# EasyEDA Pro project ProPrj_rp2040_2024-07-06.epro

# Schematic Schematic1
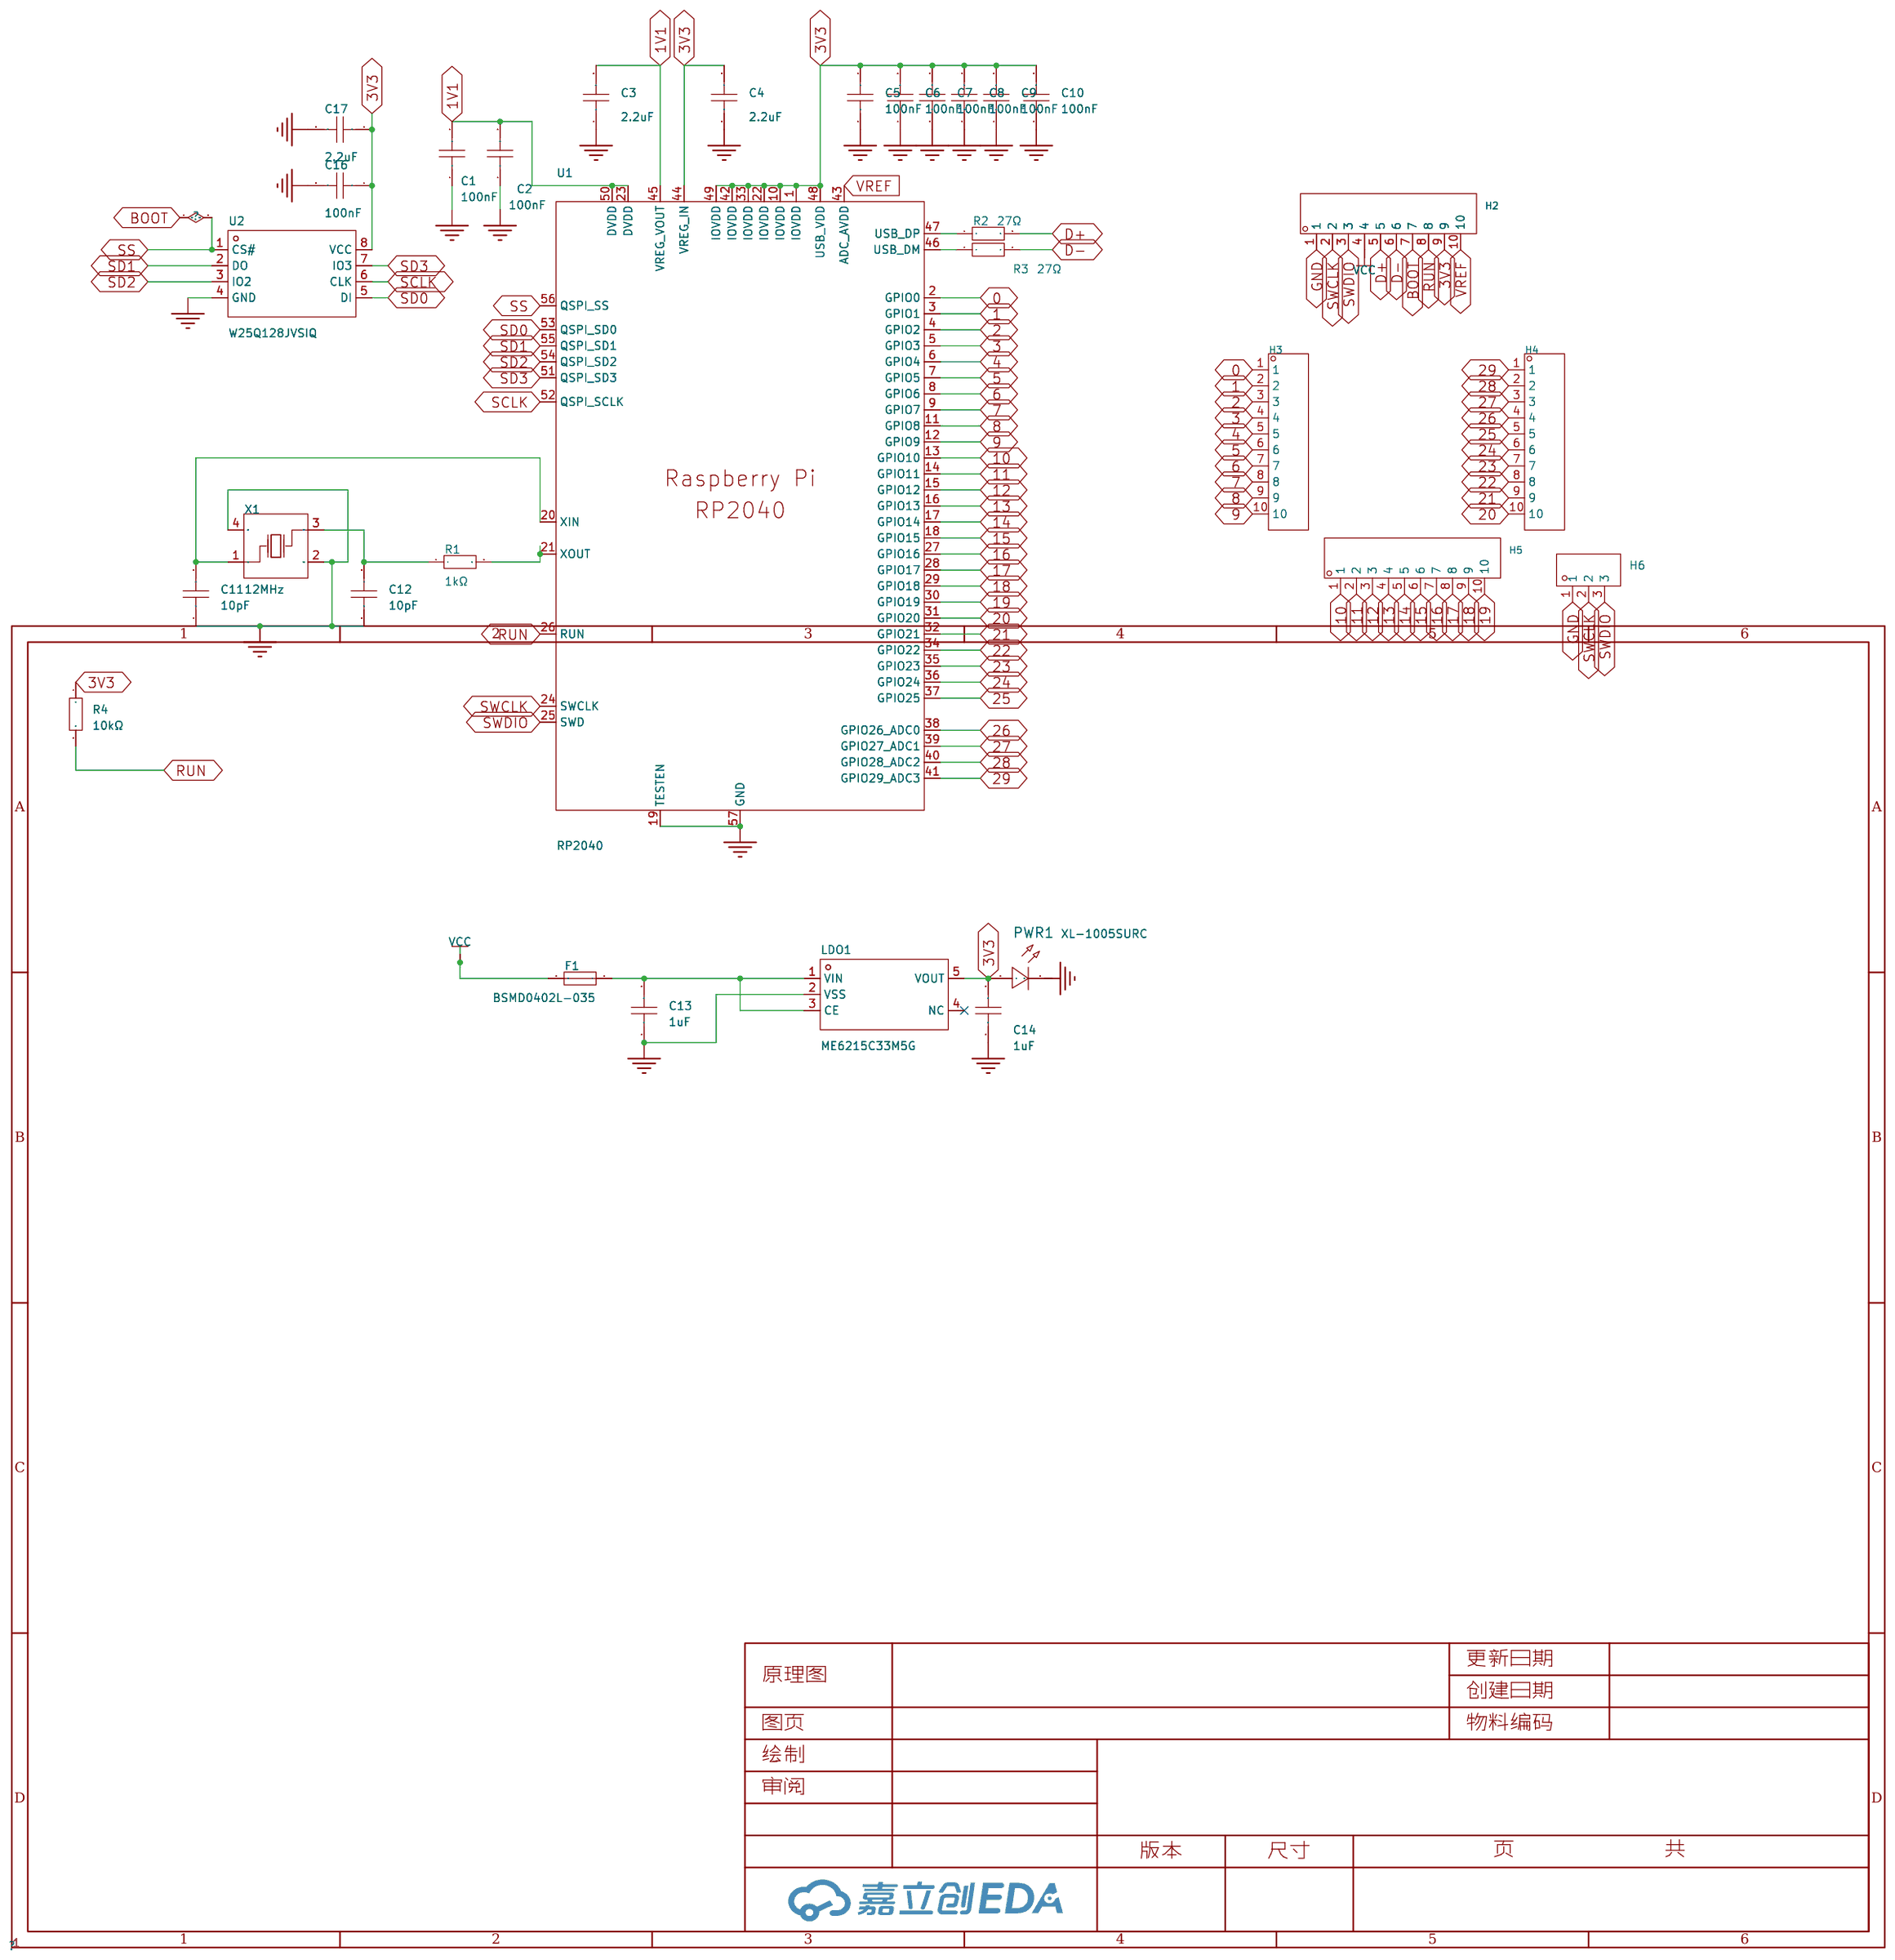
[diagram p0: schematic sheet]

## Parts
C1  100nF  [C0402]
C2  100nF  [C0402]
C3  2.2uF  [C0402]
C4  2.2uF  [C0402]
C5  100nF  [C0402]
C6  100nF  [C0402]
C7  100nF  [C0402]
C8  100nF  [C0402]
C9  100nF  [C0402]
C10  100nF  [C0402]
C11  10pF  [C0402]
C12  10pF  [C0402]
C13  1uF  [C0402]
C14  1uF  [C0402]
C16  100nF  [C0402]
C17  2.2uF  [C0402]
F1  BSMD0402L-035  [F0402]
H2  -  [HDR-TH_10P-P2.54-V-M-1]
H3  -  [HDR-TH_10P-P2.54-V-M-1]
H4  -  [HDR-TH_10P-P2.54-V-M-1]
H5  -  [HDR-TH_10P-P2.54-V-M-1]
H6  -  [HDR-TH_3P-P2.54-V-M]
LDO1  ME6215C33M5G  [SOT-23-5_L3.0-W1.7-P0.95-LS2.8-BR]
PWR1  XL-1005SURC  [LED0402-R-RD_RED]
R1  1kΩ  [R0402]
R2  27Ω  [R0402]
R3  27Ω  [R0402]
R4  10kΩ  [R0402]
U1  RP2040  [LQFN-56_L7.0-W7.0-P0.4-EP]
U2  W25Q128JVSIQ  [SOIC-8_L5.3-W5.3-P1.27-LS8.0-BL]
X1  12MHz  [CRYSTAL-SMD_4P-L3.2-W2.5-BL]

## Library data of the parts
C1 C2 C5-C10 C16 = CC0402KRX7R7BB104: 容值:100nF;精度:±10%;额定电压:16V;材质(温度系数):X7R;; LCSC Part Name: 100nF ±10% 16V; Supplier Part: C60474; Manufacturer: YAGEO(国巨); Supplier Footprint: 0402; JLCPCB Part Class: Extended Part; Datasheet: https://atta.szlcsc.com/upload/public/pdf/source/20211223/9278FD768280B81DDBEF48FA36411A03.pdf; Supplier: LCSC; Tolerance: ±10%; Voltage Rated: 16V; Temperature Coefficient: X7R; Check: true
C3 C4 C17 = CL05A225KP5NSNC: 容值:2.2uF;精度:±10%;额定电压:10V;材质(温度系数):X5R;; LCSC Part Name: 2.2uF ±10% 10V; Supplier Part: C107369; Manufacturer: SAMSUNG(三星); Supplier Footprint: 0402; JLCPCB Part Class: Extended Part; Datasheet: https://atta.szlcsc.com/upload/public/pdf/source/20160218/1457707763339.pdf; Supplier: LCSC; Tolerance: ±10%; Voltage Rated: 10V; Temperature Coefficient: X5R; Check: true
C11 C12 = 0402CG100J500NT: 容值:10pF;精度:±5%;额定电压:50V;材质(温度系数):C0G;; LCSC Part Name: 10pF ±5% 50V; Supplier Part: C1545; Manufacturer: FH(风华); Supplier Footprint: 0402; JLCPCB Part Class: Extended Part; Datasheet: https://atta.szlcsc.com/upload/public/pdf/source/20200305/C486355_26A10D38EF8C2A5C37091D0039909270.pdf; Supplier: LCSC; Tolerance: ±5%; Voltage Rated: 50V; Temperature Coefficient: C0G; Check: true
C13 C14 = CL05A105KP5NNNC: 容值:1uF;精度:±10%;额定电压:10V;材质(温度系数):X5R;; LCSC Part Name: 1uF ±10% 10V; Supplier Part: C14445; Manufacturer: SAMSUNG(三星); Supplier Footprint: 0402; JLCPCB Part Class: Extended Part; Datasheet: https://atta.szlcsc.com/upload/public/pdf/source/20160218/1457707763339.pdf; Supplier: LCSC; Tolerance: ±10%; Voltage Rated: 10V; Temperature Coefficient: X5R; Check: true
F1 = BSMD0402L-035: 最大电压:6V;最大电流:40A;保持电流:350mA;跳闸电流:700mA;; LCSC Part Name: 6V 350mA 0402自恢复; Supplier Part: C914086; Manufacturer: BHFUSE(佰宏); Supplier Footprint: 0402; JLCPCB Part Class: 扩展库; Datasheet: https://atta.szlcsc.com/upload/public/pdf/source/20230512/81993D19BE7C594631D65321B72A7525.pdf; Supplier: LCSC; Operating Voltage (Max): 6V; Current Rating (Max): 40A; Hold Current: 350mA; Trip Current: 700mA; Power Dissipation: 500mW; Resistance - Initial (Ri) (Min): 50mΩ; Resistance - Post Trip (R1) (Max): 700mΩ; Maximum Time to Trip: 100ms; Operating Temperature: -40℃~+85℃; Check: true
H2-H5 = HDR-M_2.54_1x10P: Supplier Part: C57369; Supplier Footprint: 插件; Check: false
H6 = HDR-M_2.54_1x3P: Supplier Part: C2937625; Supplier Footprint: 插件; Check: false
LDO1 = ME6215C33M5G: 输出类型:固定;最大输入电压:18V;输出电压:3.3V;最大输出电流:350mA;电源纹波抑制比(PSRR):-;输出极性:正极;; LCSC Part Name: 输入18V 输出3.3V 350mA; Supplier Part: C84119; Manufacturer: MICRONE(南京微盟); Supplier Footprint: SOT-23-5; JLCPCB Part Class: 扩展库; Datasheet: https://atta.szlcsc.com/upload/public/pdf/source/20161013/1476322246618.pdf; Supplier: LCSC; Output Type: 固定; Maximum Input Voltage: 18V; Output Voltage: 3.3V; MAX Output Current: 350mA; Dropout Voltage: 320mV@(200mA); Output Polarity: 正极; Number of Outputs: 1; Check: true
PWR1 = XL-1005SURC: 发光颜色:红色;功率:55mW;正向电流:25mA;主波长:620nm;透镜颜色:无色透明透镜;色温:6000K~7000K;发光角度:120°;载带方式:正贴;工作温度:-30℃~+85℃;; Supplier Part: C965790; Manufacturer: XINGLIGHT(成兴光); Supplier Footprint: 0402; JLCPCB Part Class: Extended Part; Datasheet: https://atta.szlcsc.com/upload/public/pdf/source/20221102/EBA3AB29C2D5B62EE70B36967F8F8809.pdf; Supplier: LCSC; Emitted Color: 红色; Power Dissipation: 55mW; Forward Current: 25mA; Dominant Wavelength: 620nm; Peak Wavelength: 625nm; Lens Color: 无色透明透镜; Color Temperature: 6000K~7000K; Viewing Angle: 120°; Mounting Sytle: 正贴; Operating Temperature: -30℃~+85℃; Check: true
R1 = 0402WGF1001TCE: 电阻类型:厚膜电阻;阻值:1kΩ;精度:±1%;功率:62.5mW;最大工作电压:50V;温度系数:±100ppm/℃;; LCSC Part Name: 1kΩ ±1% 62.5mW 厚膜电阻; Supplier Part: C11702; Manufacturer: UNI-ROYAL(厚声); Supplier Footprint: 0402; JLCPCB Part Class: Basic Part; Datasheet: https://atta.szlcsc.com/upload/public/pdf/source/20200306/C422600_1E6D84923E4A46A82E41ADD87F860B5C.pdf; Supplier: LCSC; Type: 厚膜电阻; Tolerance: ±1%; Power(Watts): 62.5mW; Overload Voltage (Max): 50V; Temperature Coefficient: ±100ppm/℃; Operating Temperature Range: -55℃~+155℃; Check: true
R2 R3 = 0402WGF270JTCE: 电阻类型:厚膜电阻;阻值:27Ω;精度:±1%;功率:62.5mW;最大工作电压:50V;温度系数:±100ppm/℃;; LCSC Part Name: 27Ω ±1% 62.5mW 厚膜电阻; Supplier Part: C25100; Manufacturer: UNI-ROYAL(厚声); Supplier Footprint: 0402; JLCPCB Part Class: Extended Part; Datasheet: https://atta.szlcsc.com/upload/public/pdf/source/20200306/C422600_1E6D84923E4A46A82E41ADD87F860B5C.pdf; Supplier: LCSC; Type: 厚膜电阻; Tolerance: ±1%; Power(Watts): 62.5mW; Overload Voltage (Max): 50V; Temperature Coefficient: ±100ppm/℃; Operating Temperature Range: -55℃~+155℃; Check: true
R4 = RC0402FR-0710KL: 电阻类型:厚膜电阻;阻值:10kΩ;精度:±1%;功率:62.5mW;最大工作电压:50V;温度系数:±100ppm/℃;; LCSC Part Name: 厚膜电阻 10kΩ ±1% 62.5mW; Supplier Part: C60490; Manufacturer: YAGEO(国巨); Supplier Footprint: 0402; JLCPCB Part Class: Extended Part; Datasheet: https://atta.szlcsc.com/upload/public/pdf/source/20170925/C131467_1506321478108990263.pdf; Supplier: LCSC; Type: 厚膜电阻; Tolerance: ±1%; Power(Watts): 62.5mW; Overload Voltage (Max): 50V; Temperature Coefficient: ±100ppm/℃; Operating Temperature Range: -55℃~+155℃; Check: true
U1 = RP2040_C2040: CPU内核:-;RAM总容量:264KB;GPIO端口数量:30;工作电压范围:-;CPU最大主频:133MHz;程序存储器类型:-;应用领域:-;; LCSC Part Name: RP2040（RP2B2）; Supplier Part: C2040; Manufacturer: Raspberry Pi(树莓派); Supplier Footprint: LQFN-56(7x7); JLCPCB Part Class: 扩展库; Datasheet: https://atta.szlcsc.com/upload/public/pdf/source/20210621/C2040_96F425825606B7957D87DD32E2512CA9.pdf; Supplier: LCSC; RAM Size: 264KB; GPIO Ports Number: 30; CPU Maximum Speed: 133MHz; ADC (Bit): 12bit; UART/USART: 2; I2C: 2; SPI: 2; Universal Serial Bus: 有; Peripheral/Function: DMA；PWM; Direct Memory Access: 有; Check: true
U2 = W25Q128JVSIQ: 接口类型:-;存储容量:128Mbit;时钟频率(fc):-;; LCSC Part Name: W25Q128JVSIQ 编带; Supplier Part: C97521; Manufacturer: WINBOND(华邦); Supplier Footprint: SOIC-8-208mil; JLCPCB Part Class: 基础库; Datasheet: https://atta.szlcsc.com/upload/public/pdf/source/20170316/1489627409956.pdf; Supplier: LCSC; Memory Size: 128Mbit; Check: true
X1 = SX3B12.000F1510F30: 晶振类型:贴片晶振;频率:12MHz;常温频差:±10ppm;外接负载电容:15pF;频率稳定度(全温):±30ppm;; LCSC Part Name: 12MHz ±10ppm 15pF; Supplier Part: C2901651; Manufacturer: SCTF(星通时频); Supplier Footprint: SMD3225-4P; JLCPCB Part Class: Extended Part; Datasheet: https://atta.szlcsc.com/upload/public/pdf/source/20211009/5A52FEEAB809802F11C53C4F9B1D6590.pdf; Supplier: LCSC; Crystal Type: 贴片晶振; Normal temperature Frequency Tolerance: ±10ppm; External load capacitor: 15pF; Frequency Stability(Full temperature range): ±30ppm; Equivalent Series Resistance (ESR): 100Ω; Operating Temperature: -40℃~+85℃; Check: true

## Nets
1V1: C1.2 C2.2 C3.2 U1.23(DVDD) U1.45(VREG_VOUT) U1.50(DVDD)
3V3: C4.2 C5.2 C6.2 C7.2 C8.2 C9.2 C10.2 C14.2 C16.1 C17.1 H2.9 LDO1.5(VOUT) PWR1.2(A) R4.1 U1.1(IOVDD) U1.10(IOVDD) U1.22(IOVDD) U1.33(IOVDD) U1.42(IOVDD) U1.44(VREG_IN) U1.48(USB_VDD) U1.49(IOVDD) U2.8(VCC)
GND: C1.1 C2.1 C3.1 C4.1 C5.1 C6.1 C7.1 C8.1 C9.1 C10.1 C11.1 C12.1 C13.1 C14.1 C16.2 C17.2 H2.1 H6.1 LDO1.2(VSS) PWR1.1(C) U1.19(TESTEN) U1.57(GND) U2.4(GND) X1.2(GND) X1.4(GND)
VCC: F1.2 H2.4
0: H3.1 U1.2(GPIO0)
1: H3.2 U1.3(GPIO1)
2: H3.3 U1.4(GPIO2)
3: H3.4 U1.5(GPIO3)
4: H3.5 U1.6(GPIO4)
5: H3.6 U1.7(GPIO5)
6: H3.7 U1.8(GPIO6)
7: H3.8 U1.9(GPIO7)
8: H3.9 U1.11(GPIO8)
9: H3.10 U1.12(GPIO9)
10: H5.1 U1.13(GPIO10)
11: H5.2 U1.14(GPIO11)
12: H5.3 U1.15(GPIO12)
13: H5.4 U1.16(GPIO13)
14: H5.5 U1.17(GPIO14)
15: H5.6 U1.18(GPIO15)
16: H5.7 U1.27(GPIO16)
17: H5.8 U1.28(GPIO17)
18: H5.9 U1.29(GPIO18)
19: H5.10 U1.30(GPIO19)
20: H4.10 U1.31(GPIO20)
21: H4.9 U1.32(GPIO21)
22: H4.8 U1.34(GPIO22)
23: H4.7 U1.35(GPIO23)
24: H4.6 U1.36(GPIO24)
25: H4.5 U1.37(GPIO25)
26: H4.4 U1.38(GPIO26_ADC0)
27: H4.3 U1.39(GPIO27_ADC1)
28: H4.2 U1.40(GPIO28_ADC2)
29: H4.1 U1.41(GPIO29_ADC3)
BOOT: H2.7 U1.56(QSPI_SS) U2.1(CS#)
D+: H2.5 R2.2
D-: H2.6 R3.2
RUN: H2.8 R4.2 U1.26(RUN)
SCLK: U1.52(QSPI_SCLK) U2.6(CLK)
SD0: U1.53(QSPI_SD0) U2.5(DI)
SD1: U1.55(QSPI_SD1) U2.2(DO)
SD2: U1.54(QSPI_SD2) U2.3(IO2)
SD3: U1.51(QSPI_SD3) U2.7(IO3)
SWCLK: H2.2 H6.2 U1.24(SWCLK)
SWDIO: H2.3 H6.3 U1.25(SWD)
VREF: H2.10 U1.43(ADC_AVDD)
$1N2199: C11.2 U1.20(XIN) X1.1(OSC1)
$1N2386: R1.2 U1.21(XOUT)
$1N2391: C12.2 R1.1 X1.3(OSC2)
$1N3425: C13.2 F1.1 LDO1.1(VIN) LDO1.3(CE)
$1N3838: R2.1 U1.47(USB_DP)
$1N3897: R3.1 U1.46(USB_DM)

Not connected (* = marked no-connect by the designer): LDO1 4(NC)*

# Board PCB1
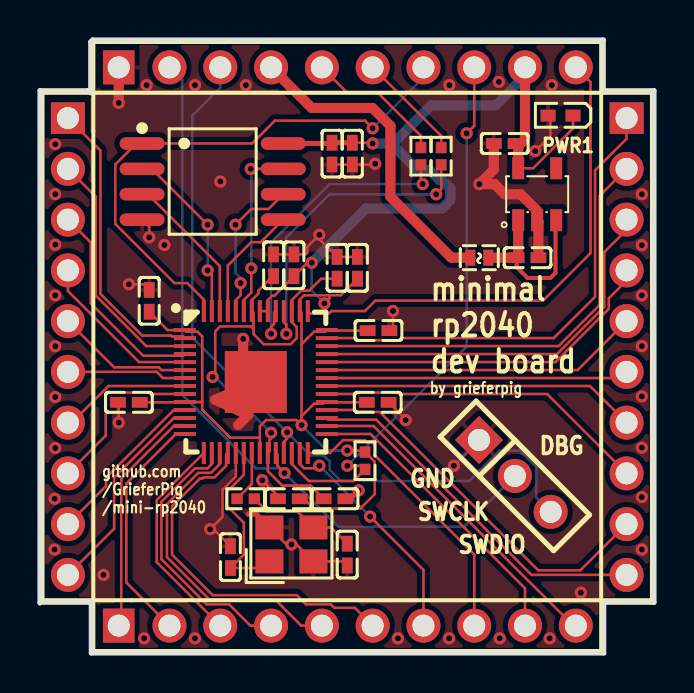
[diagram p1: board, top side]
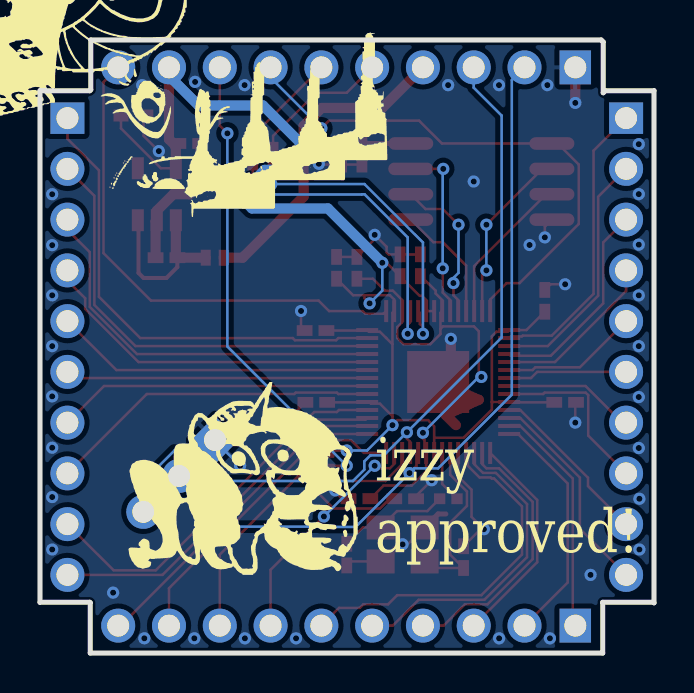
[diagram p2: board, bottom side, seen from below]

Outline 30.71 x 30.68 mm; copper layers: Top Layer, Inner1, Inner2, Bottom Layer. Coordinates in mm from the lower left corner of the outline.
Outline path: 0,28.14 2.44,28.14 2.54,28.04 2.54,30.58 2.64,30.68 28.17,30.68 28.17,28.19 28.22,28.14 30.71,28.14 30.71,2.54 28.22,2.54 28.19,2.51 28.19,0 2.57,0 2.57,2.54 0.03,2.54 0,2.51 0,28.14
Stack: Top Layer 0.035mm 外层铜厚1oz / Dielectric1 0.2104mm 7628 RC49% 8.6mil / Inner1 0.0152mm 内层铜厚 / Dielectric2 1.065mm 1.1mm H/HOZ Copper / Inner2 0.0152mm 内层铜厚 / Dielectric3 0.2104mm 7628 RC49% 8.6mil / Bottom Layer 0.035mm 外层铜厚1oz

## Design rules (mm)
template: 自定义配置
spacing copperThickness1oz (default): track to track 0.102, other pairs 0.152 to 0.3
spacing copperThickness2oz: track to track 0.203, other pairs 0.152 to 0.3
track width copperThickness1oz (default): min 0.127, default 0.127, max 2.54
track width copperThickness2oz: min 0.203, default 0.254, max 2.54
differential pair differentialPair (default): width min 0.127, default 0.254, max 2.54; gap min 0.152, default 0.152
via viaSize (default): diameter min 0.5, default 0.61, max 10; hole min 0.3, default 0.305, max 6.3

## Placement (name value [footprint] x y rotation side)
C1  100nF  [C0402]  11.68 19.41 270 top
C2  100nF  [C0402]  14.73 7.72 180 top
C3  2.2uF  [C0402]  14.86 19.28 270 top
C4  2.2uF  [C0402]  15.88 19.28 270 top
C5  100nF  [C0402]  12.7 19.41 270 top
C6  100nF  [C0402]  16.93 16.14 180 top
C7  100nF  [C0402]  16.89 12.55 180 top
C8  100nF  [C0402]  4.44 12.55 0 top
C9  100nF  [C0402]  12.45 7.72 0 top
C10  100nF  [C0402]  5.46 17.63 270 top
C11  10pF  [C0402]  9.52 4.8 270 top
C12  10pF  [C0402]  15.37 4.93 90 top
C13  1uF  [C0402]  24.38 19.79 180 top
C14  1uF  [C0402]  23.24 25.5 0 top
C16  100nF  [C0402]  14.6 24.99 270 top
C17  2.2uF  [C0402]  15.62 24.99 270 top
F1  BSMD0402L-035  [F0402]  21.97 19.79 180 top
H2  -  [HDR-TH_10P-P2.54-V-M-1]  15.37 29.31 0 top
H3  -  [HDR-TH_10P-P2.54-V-M-1]  1.4 15.34 270 top
H4  -  [HDR-TH_10P-P2.54-V-M-1]  29.34 15.34 270 top
H5  -  [HDR-TH_10P-P2.54-V-M-1]  15.37 1.37 0 top
H6  -  [HDR-TH_3P-P2.54-V-M]  23.75 8.86 314.9 top
LDO1  ME6215C33M5G  [SOT-23-5_L3.0-W1.7-P0.95-LS2.8-BR]  24.87 22.96 270 top
PWR1  XL-1005SURC  [LED0402-R-RD_RED]  26.03 26.9 180 top
R1  1kΩ  [R0402]  10.29 7.72 180 top
R2  27Ω  [R0402]  19.05 24.87 90 top
R3  27Ω  [R0402]  20.07 24.87 90 top
R4  10kΩ  [R0402]  16.26 9.63 270 top
U1  RP2040  [LQFN-56_L7.0-W7.0-P0.4-EP]  10.79 13.56 0 top
U2  W25Q128JVSIQ  [SOIC-8_L5.3-W5.3-P1.27-LS8.0-BL]  8.64 23.6 270 top
X1  12MHz  [CRYSTAL-SMD_4P-L3.2-W2.5-BL]  12.57 5.44 0 top

## Footprints (pads in the part's own frame, mm; a bottom-side part is the same pattern mirrored in y, then rotated)
C0402
  rect 0.79x0.54 smd: 1(-0.545,0) 2(0.545,0)
CRYSTAL-SMD_4P-L3.2-W2.5-BL
  rect 1.4x1.2 smd: 1(-1.1,-0.85) 2(1.1,-0.85) 3(1.1,0.85) 4(-1.1,0.85)
F0402
  rect 0.5x0.8 smd: 1(-0.45,0) 2(0.45,0)
HDR-TH_3P-P2.54-V-M
  rect 1.7x1.7 hole 1.1: 1(-2.54,0)
  round 1.7 hole 1.1: 2(0,0) 3(2.54,0)
HDR-TH_10P-P2.54-V-M-1
  rect 1.575x1.7 hole 1.1: 1(-11.43,0)
  round 1.7 hole 1.1: 2(-8.89,0) 3(-6.35,0) 4(-3.81,0) 5(-1.27,0) 6(1.27,0) 7(3.81,0) 8(6.35,0) 9(8.89,0) 10(11.43,0)
LED0402-R-RD_RED
  rect 0.75x0.6 smd: 1(0.623,0) 2(-0.623,0)
LQFN-56_L7.0-W7.0-P0.4-EP
  rect 1.1x0.2 smd: 1(-3.55,2.6) 2(-3.55,2.2) 3(-3.55,1.8) 4(-3.55,1.4) 5(-3.55,1) 6(-3.55,0.6) 7(-3.55,0.2) 8(-3.55,-0.2) 9(-3.55,-0.6) 10(-3.55,-1) 11(-3.55,-1.4) 12(-3.55,-1.8) 13(-3.55,-2.2) 14(-3.55,-2.6) 29(3.55,-2.6) 30(3.55,-2.2) 31(3.55,-1.8) 32(3.55,-1.4) 33(3.55,-1) 34(3.55,-0.6) 35(3.55,-0.2) 36(3.55,0.2) 37(3.55,0.6) 38(3.55,1) 39(3.55,1.4) 40(3.55,1.8) 41(3.55,2.2) 42(3.55,2.6)
  rect 0.2x1.1 smd: 15(-2.6,-3.55) 16(-2.2,-3.55) 17(-1.8,-3.55) 18(-1.4,-3.55) 19(-1,-3.55) 20(-0.6,-3.55) 21(-0.2,-3.55) 22(0.2,-3.55) 23(0.6,-3.55) 24(1,-3.55) 25(1.4,-3.55) 26(1.8,-3.55) 27(2.2,-3.55) 28(2.6,-3.55) 43(2.6,3.55) 44(2.2,3.55) 45(1.8,3.55) 46(1.4,3.55) 47(1,3.55) 48(0.6,3.55) 49(0.2,3.55) 50(-0.2,3.55) 51(-0.6,3.55) 52(-1,3.55) 53(-1.4,3.55) 54(-1.8,3.55) 55(-2.2,3.55) 56(-2.6,3.55)
  rect 3.1x3.1 smd: 57(0,0)
R0402
  rect 0.566x0.54 smd: 1(-0.433,0) 2(0.433,0)
SOIC-8_L5.3-W5.3-P1.27-LS8.0-BL
  oval 0.63x2.25 smd: 1(-1.905,-3.53) 2(-0.635,-3.53) 3(0.635,-3.53) 4(1.905,-3.53) 5(1.905,3.53) 6(0.635,3.53) 7(-0.635,3.53) 8(-1.905,3.53)
SOT-23-5_L3.0-W1.7-P0.95-LS2.8-BR
  rect 1.1x0.6 smd: 1(1.3,-0.95) 2(1.3,0) 3(1.3,0.95) 4(-1.3,0.95) 5(-1.3,-0.95)

## Nets
As in the schematic.

Pads without a net: LDO1 4

## Via types
v1: diameter 0.61, hole 0.305, Top Layer to Bottom Layer, 73 vias

## Routing (per net, layer and track width the routed paths; a pad name or vN(x,y) marks a point on that pad's centre or on a via; arc(x,y) is an arc through that point)
1V1: length 24.5
  Top Layer w0.127: 10.68,16.23 10.68,17.03 U1.50 10.59,17.67 10.92,18 10.92,18.14 11.65,18.86 C1.2 ; 10.68,16.23 10.68,15.96 11.19,15.46 12.53,15.46 12.84,15.76 12.84,16.31 12.59,16.56 U1.45 12.59,17.67 13.06,18.14 13.46,18.14 14.06,18.73 C3.2 ; 10.68,16.23 10.56,16.35 9.01,16.35 8.76,16.1 8.76,13.94 v1(8.64,13.82) ; C2.2 13.53,8.38 12.12,8.38 11.39,9.1 U1.23 11.48,10.1 11.48,10.65 11.56,10.73 v1(11.56,11.02)
  Bottom Layer w0.127: v1(8.64,13.82) 8.76,13.82 v1(11.56,11.02)
3V3: length 87.3
  Top Layer w0.127: U1.49 U1.48 11.39,17.67 11.61,17.88 11.72,17.88 C5.2 13.37,19.53 v1(13.59,19.53) ; 10.99,10.78 U1.22 ; 10.99,10.78 9.52,10.78 8.11,12.18 8.11,12.56 ; 10.99,10.78 10.99,11.35 11.3,11.66 12.83,11.66 v1(13.08,11.4) 13.08,11.85 ; v1(16.64,25.5) 16.6,25.54 C17.1 ; 14.48,17.91 14.48,17.75 v1(14.22,17.5) ; 14.48,17.91 13.21,17.91 12.99,17.69 U1.44 13.08,17.03 13.08,15.45 ; 14.48,17.91 15.05,17.91 C4.2 ; v1(15.37,10.13) 16.18,10.13 R4.1 16.74,9.57 16.74,7.95 16.02,7.24 13.7,7.24 13.22,7.72 C9.2 ; C10.2 6.38,16.16 U1.1 7.33,16.08 7.88,16.08 8.11,15.85 8.11,12.56 ; 8.11,12.56 U1.10 7.23,12.55 C8.2 ; 13.08,11.85 13.71,12.48 14.16,12.48 14.24,12.56 U1.33 14.36,12.55 16.35,12.55 ; 13.08,11.85 13.08,15.45 ; 13.4,15.77 13.08,15.45 ; 13.4,15.77 13.39,15.77 ; 13.4,15.77 13.71,16.08 14.26,16.08 U1.42 14.37,16.14 C6.2 ; PWR1.2 26.66,26.26 24.66,24.26 23.92,24.26
  Top Layer w0.254: C17.1 C16.1 14.57,25.5 11.53,25.5
  Top Layer w0.508: 23.92,25.37 23.92,24.26 ; 23.92,25.37 C14.2 ; 23.92,25.37 24.26,25.71 H2.9
  Bottom Layer w0.127: v1(13.08,11.4) 14.35,10.13 v1(15.37,10.13) ; v1(14.22,17.5) 13.59,18.14 v1(13.59,19.53)
  Bottom Layer w0.508: v1(13.59,19.53) 16.31,22.25 20.11,22.25 20.52,22.67 20.52,23.26 20.11,23.67 19.98,23.67 19.47,24.18 18.88,24.18 17.65,25.41 17.65,25.5 ; 24.26,28.88 22.78,27.41 19.56,27.41 17.65,25.5 ; 17.65,25.5 v1(16.64,25.5)
GND: length 47.9
  Top Layer w0.127: U2.4 5.46,21.34 v1(5.46,20.8) ; 11.47,6.29 12.32,5.44 v1(12.57,5.44) 12.82,5.44 X1.2 15.16,4.59 C12.1 ; C4.1 C3.1 13.97,20.71 v1(13.97,20.93) 13.37,20.33 13.37,20.05 13.27,19.95 C5.1 C1.1 ; C16.2 C17.2 16.73,24.45 v1(16.76,24.49) ; C9.1 11.9,7.86 v1(11.12,8.65) ; v1(24.76,25.12) 25.53,25.88 25.53,26.78 PWR1.1 ; C7.1 18.29,11.7 v1(18.29,11.66) ; C6.1 17.65,16.32 v1(17.65,17.12) ; v1(4.44,18.46) 5.18,18.46 C10.1 ; C11.1 8.67,6.2 v1(8.51,6.2) 9.13,6.82 9.13,8.18 9.79,8.84 U1.19 ; C8.1 3.94,12.51 v1(3.94,11.53)
  Top Layer w0.254: C2.1 15.52,7.72 v1(15.94,8.14) ; 10.41,6.96 10.8,6.96 11.47,6.29
  Top Layer w0.508: H2.1 v1(3.94,27.53) ; 9.91,11.4 10.41,11.91 8.76,12.67 U1.57 10.16,14.2 v1(10.16,15.72) ; C13.1 24.93,21.6 LDO1.2 24.87,22.14 24.04,22.96 23.24,22.96 22.73,23.47 v1(21.97,23.47) 22.7,24.19 C14.1
  Bottom Layer w0.127: H6.1 21.96,10.63 v1(20.7,9.37)
  vias: v1(0.76,25.47) v1(0.76,22.97) v1(0.76,20.44) v1(0.76,17.9) v1(0.76,15.36) v1(0.76,12.81) v1(0.76,10.26) v1(0.73,7.72) v1(0.73,5.18) v1(3.17,3.91) v1(5.21,0.74) v1(5.33,28.42) v1(6.22,20.42) v1(7.75,28.42) v1(7.75,0.74) v1(9.02,23.6) v1(10.3,28.42) v1(17.9,0.74) v1(20.47,28.42) v1(20.46,0.74) v1(22.95,28.58) v1(22.99,0.74) v1(25.49,0.74) v1(25.6,28.42) v1(27.05,3.02) v1(30.1,22.96) v1(30.1,20.41) v1(30.1,17.9) v1(30.1,15.36) v1(30.1,12.84) v1(30.1,10.28) v1(30.1,7.81) v1(30.1,5.18)
VCC: length 16
  Top Layer w0.508: F1.2 20.57,19.79 17.53,22.83 17.53,26.38 16.63,27.28 13.59,27.28 H2.4
0: length 14.6
  Top Layer w0.127: U1.2 7.16,15.85 6.61,15.85 6.57,15.89 5.11,15.89 3.02,17.98 3.02,25.15 1.4,26.77
1: length 12.4
  Top Layer w0.127: U1.3 5.31,15.36 2.79,17.88 2.79,22.83 H3.2
2: length 10.5
  Top Layer w0.127: U1.4 7.16,14.88 5.16,14.88 2.54,17.5 2.54,20.55 H3.3
3: length 8.4
  Top Layer w0.127: U1.5 4.95,14.56 1.4,18.12 H3.4
4: length 6.9
  Top Layer w0.127: H3.5 3.71,14.3 5.94,14.3 6.07,14.16 U1.6
5: length 6
  Top Layer w0.127: U1.7 6.15,13.76 5.84,14.07 H3.6
6: length 6.6
  Top Layer w0.127: U1.8 3.42,13.36 1.59,11.53 H3.7
7: length 8.7
  Top Layer w0.127: 1.4,8.99 3.29,10.88 3.29,12.91 3.42,13.03 5.47,13.03 5.54,12.96 U1.9
8: length 8.5
  Top Layer w0.127: H3.9 3.3,8.36 3.3,8.78 6.69,12.16 U1.11
9: length 10.6
  Top Layer w0.127: H3.10 3.71,6.22 3.71,8.78 6.69,11.76 U1.12
10: length 11.7
  Top Layer w0.127: H5.1 4.06,1.5 4.06,8.74 6.73,11.4 7.2,11.4 U1.13
11: length 12
  Top Layer w0.127: H5.2 4.32,3.53 4.32,8.48 6.8,10.96 U1.14
12: length 10.9
  Top Layer w0.127: U1.15 5.84,7.66 5.84,4.55 H5.3
13: length 13.6
  Top Layer w0.127: U1.16 8.59,9.46 8.38,9.25 7.75,9.25 6.07,7.57 6.07,4.7 8.33,2.44 9.46,2.44 10.52,1.37 H5.4
14: length 15.9
  Top Layer w0.127: U1.17 8.99,9.46 8.55,9.02 7.91,9.02 6.35,7.46 6.35,4.8 8.48,2.67 11.77,2.67 13.06,1.37 H5.5
15: length 18.1
  Top Layer w0.127: U1.18 9.31,9.93 9.31,9.37 8.72,8.79 8.17,8.79 8.12,8.74 8,8.74 6.6,7.34 6.6,4.93 8.64,2.9 12.84,2.9 13.3,2.44 14.54,2.44 14.71,2.26 15.75,2.26 H5.6
16: length 11.7
  Top Layer w0.127: v1(16.51,6.83) 19.18,4.17 H5.7 ; 13.92,9.25 13.76,9.25 13.76,9.25 13.21,9.25 12.99,9.46 U1.27
  Bottom Layer w0.127: v1(13.97,9.37) v1(16.51,6.83)
17: length 14.8
  Top Layer w0.127: U1.28 14.51,10.01 15.15,10.65 16.24,10.65 16.34,10.56 16.62,10.56 16.74,10.43 16.74,9.9 21.72,4.93 H5.8
18: length 15
  Top Layer w0.127: U1.29 16.53,10.96 24.26,3.24 H5.9
19: length 16.6
  Top Layer w0.127: U1.30 16.68,11.36 26.67,1.37 H5.10
20: length 18.2
  Top Layer w0.127: U1.31 14.43,11.68 16.81,11.68 24.58,3.91 H4.10
21: length 19.3
  Top Layer w0.127: U1.32 15.76,12.16 15.86,12.06 17,12.06 24.92,4.14 27.03,4.14 H4.9
22: length 16.7
  Top Layer w0.127: U1.34 15.79,12.96 15.86,13.03 17.92,13.03 17.99,12.96 25.36,12.96 29.34,8.99
23: length 15.8
  Top Layer w0.127: H4.7 27.5,13.36 U1.35
24: length 15.1
  Top Layer w0.127: H4.6 29.03,13.76 U1.36
25: length 16
  Top Layer w0.127: H4.5 26.89,14.16 U1.37
26: length 17.5
  Top Layer w0.127: U1.38 25.78,14.56 28.45,17.23 28.45,17.75 29.34,18.64 H4.4
27: length 19.7
  Top Layer w0.127: H4.3 29.34,21.18 28.22,20.07 28.22,17.32 25.86,14.96 U1.39
28: length 21.9
  Top Layer w0.127: H4.2 27.99,22.88 27.99,17.42 25.93,15.36 U1.40
29: length 24
  Top Layer w0.127: U1.41 15.79,15.76 15.9,15.65 17.96,15.65 18.07,15.76 25.69,15.76 27.76,17.83 27.76,24.16 29.34,25.74 29.34,26.77
BOOT: length 27.6
  Top Layer w0.127: v1(16.64,26.26) 16.26,26.64 11.75,26.64 10.61,25.5 U2.1 4.82,25.5 3.77,24.45 3.77,21.47 6.72,18.52 7.37,18.52 8.19,17.69 U1.56
  Bottom Layer w0.127: v1(16.64,26.26) 19.18,28.8 H2.7
D+: length 7
  Top Layer w0.127: R2.2 19.05,25.88 16.89,28.04 15.37,28.04 H2.5
D-: length 5.4
  Top Layer w0.127: H2.6 20.07,25.88 R3.2
RUN: length 28.4
  Top Layer w0.127: H2.8 21.72,26.39 v1(21.34,26.01) ; v1(15.37,9.37) 16.08,9.37 16.26,9.19 15.67,8.61 13.44,8.61 12.59,9.46 U1.26
  Bottom Layer w0.127: v1(21.34,26.01) 21.34,15.34 18.17,12.18 18.07,12.18 17.77,11.87 17.77,11.77 v1(15.37,9.37)
SCLK: length 7.5
  Top Layer w0.127: v1(9.78,21.44) 10.56,22.22 11.43,22.22 U2.6 ; v1(10.03,18.52) 10.03,17.91 9.79,17.67 U1.52
  Bottom Layer w0.127: v1(9.78,21.44) 9.78,19.02 10.03,18.77 v1(10.03,18.52)
SD0: length 6
  Top Layer w0.127: U2.5 11.04,20.56 10.56,20.56 9.39,19.39 U1.53
SD1: length 8.8
  Top Layer w0.127: U1.55 8.59,18.94 v1(8.38,19.15) ; U2.2 5.59,24.23 v1(8.38,21.44)
  Bottom Layer w0.127: v1(8.38,21.44) v1(8.38,19.15)
SD2: length 7.6
  Top Layer w0.127: U1.54 8.99,19.36 5.4,22.96 U2.3
SD3: length 8.9
  Top Layer w0.127: U2.7 v1(10.54,24.23) ; U1.51 10.19,17.67 10.57,18.04 v1(10.57,19.25)
  Bottom Layer w0.127: v1(10.57,19.25) 10.57,24.2 v1(10.54,24.23)
SWCLK: length 38.3
  Top Layer w0.127: v1(12.23,9.01) 12.23,9.02 11.88,9.37 11.88,9.93 U1.24
  Bottom Layer w0.127: H2.2 7.11,28.68 7.11,12.93 10.79,9.25 11.99,9.25 v1(12.23,9.01) 14.92,6.31 16.73,6.31 16.74,6.32 21.21,6.32 H6.2
SWDIO: length 39.2
  Top Layer w0.127: v1(12.36,11.05) 12.36,10.73 12.19,10.57 U1.25
  Bottom Layer w0.127: H2.3 9.02,28.3 7.62,26.9 7.62,15.79 v1(12.36,11.05) 13.51,9.89 14.19,9.89 14.49,9.59 14.49,9.18 15.06,8.61 15.67,8.61 15.72,8.66 16.15,8.66 16.2,8.61 21.46,8.61 22.99,10.13 23.99,10.13 24.81,9.31 24.81,7.79 H6.3
VREF: length 25.1
  Top Layer w0.127: H2.10 27.53,28.58 27.53,20.01 25.16,17.64 16.78,17.64 16.25,17.11 14.57,17.11 14.44,16.98 13.53,16.98 U1.43
$1N2199: length 8.8
  Top Layer w0.127: U1.20 10.19,8.92 9.36,8.08 9.36,7.36 10.19,6.52 10.19,4.93 C11.2 11.14,4.26 X1.1
$1N2386: length 2.6
  Top Layer w0.127: U1.21 10.59,8.46 R1.2
$1N2391: length 5.6
  Top Layer w0.127: 10.72,7.72 11.34,7.1 12.86,7.1 13.67,6.29 14.55,6.29 C12.2
$1N3425: length 8.7
  Top Layer w0.203: C13.2 23.84,19.32 24.38,18.77 25.53,18.77 25.78,19.02 25.78,21.63 LDO1.3
  Top Layer w0.508: F1.1 C13.2 23.92,19.86 LDO1.1
$1N3838: length 15.6
  Top Layer w0.127: v1(11.56,15.98) 11.56,16.32 11.71,16.47 11.71,17.03 U1.47 ; v1(19.14,23.47) 19.05,23.56 19.05,24.43
  Bottom Layer w0.127: v1(11.56,15.98) 11.56,20.55 14.48,23.47 v1(19.14,23.47)
$1N3897: length 16
  Top Layer w0.127: v1(12.32,15.98) 12.32,16.43 12.19,16.56 U1.46 ; 20.07,24.43 20.07,23.22 v1(19.81,22.96)
  Bottom Layer w0.127: v1(19.81,22.96) 19.41,22.96 19.39,22.95 14.62,22.95 14.6,22.96 14.48,22.96 12.32,20.8 v1(12.32,15.98)

## Copper pours and planes (outline as drawn; the poured copper is in the pictures)
GND on Top Layer: -3.68,33.5 34.92,33.5 34.92,-2.82 -3.68,-2.82
GND on Bottom Layer: -5.08,34.14 33.66,34.14 33.66,-2.31 -5.08,-2.31
GND on Inner1: 0.26,30.43 30.45,30.43 30.45,0.26 0.26,0.26
GND on Inner2: 0.26,30.43 30.45,30.43 30.45,0.26 0.26,0.26

Small or netless copper shapes (teardrops, artwork), in the pictures only: 6 on Inner1, 6 on Inner2

## Text on the board
Bottom Silkscreen Layer: izzy / approved!
Top Silkscreen Layer: github.com / /GrieferPig / /mini-rp2040 | by grieferpig | GND | SWCLK | SWDIO | DBG | minimal / rp2040 / dev board
